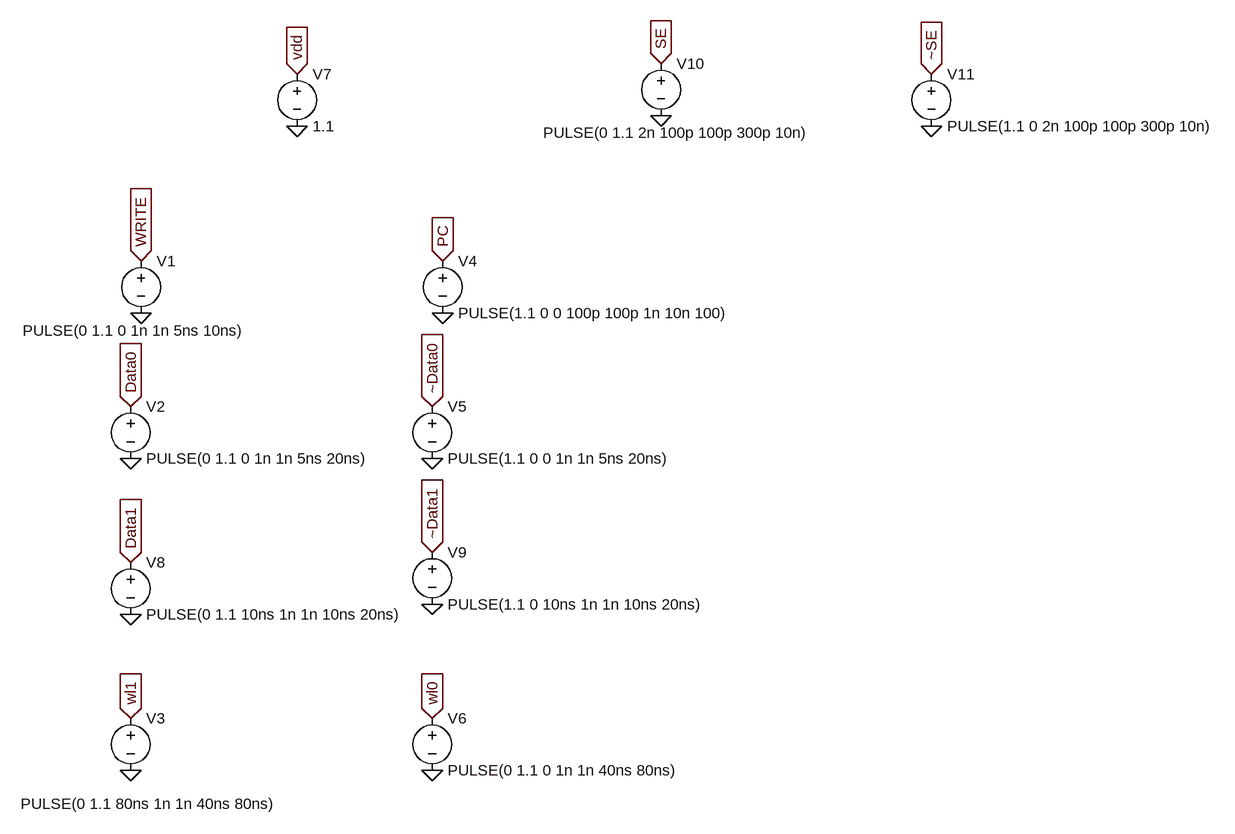
[diagram p0: schematic voltages.asc]
voltages.asc, the LTspice schematic file:
Version 4
SHEET 1 2000 680
FLAG 560 -384 0
FLAG 784 -96 0
FLAG 320 -96 0
FLAG 304 128 0
FLAG 768 128 0
FLAG 304 608 0
FLAG 768 608 0
FLAG 320 -176 WRITE
IOPIN 320 -176 In
FLAG 784 -176 PC
IOPIN 784 -176 In
FLAG 304 48 Data0
IOPIN 304 48 In
FLAG 768 48 ~Data0
IOPIN 768 48 In
FLAG 304 528 wl1
IOPIN 304 528 In
FLAG 768 528 wl0
IOPIN 768 528 In
FLAG 560 -464 vdd
IOPIN 560 -464 In
FLAG 768 352 0
FLAG 304 368 0
FLAG 304 288 Data1
IOPIN 304 288 In
FLAG 768 272 ~Data1
IOPIN 768 272 In
FLAG 1536 -384 0
FLAG 1120 -400 0
FLAG 1120 -480 SE
IOPIN 1120 -480 In
FLAG 1536 -464 ~SE
IOPIN 1536 -464 In
SYMBOL voltage 320 -192 R0
WINDOW 123 0 0 Left 2
WINDOW 39 0 0 Left 2
WINDOW 3 -182 123 Left 2
SYMATTR InstName V1
SYMATTR Value PULSE(0 1.1 0 1n 1n 5ns 10ns)
SYMBOL voltage 304 32 R0
WINDOW 123 0 0 Left 2
WINDOW 39 0 0 Left 2
SYMATTR InstName V2
SYMATTR Value PULSE(0 1.1 0 1n 1n 5ns 20ns)
SYMBOL voltage 304 512 R0
WINDOW 3 -169 147 Left 2
WINDOW 123 0 0 Left 2
WINDOW 39 0 0 Left 2
SYMATTR Value PULSE(0 1.1 80ns 1n 1n 40ns 80ns)
SYMATTR InstName V3
SYMBOL voltage 784 -192 R0
WINDOW 123 0 0 Left 2
WINDOW 39 0 0 Left 2
SYMATTR InstName V4
SYMATTR Value PULSE(1.1 0 0 100p 100p 1n 10n 100)
SYMBOL voltage 768 32 R0
WINDOW 123 0 0 Left 2
WINDOW 39 0 0 Left 2
SYMATTR InstName V5
SYMATTR Value PULSE(1.1 0 0 1n 1n 5ns 20ns)
SYMBOL voltage 768 512 R0
WINDOW 123 0 0 Left 2
WINDOW 39 0 0 Left 2
SYMATTR InstName V6
SYMATTR Value PULSE(0 1.1 0 1n 1n 40ns 80ns)
SYMBOL voltage 560 -480 R0
WINDOW 123 0 0 Left 2
WINDOW 39 0 0 Left 2
SYMATTR InstName V7
SYMATTR Value 1.1
SYMBOL voltage 304 272 R0
WINDOW 123 0 0 Left 0
WINDOW 39 0 0 Left 0
SYMATTR InstName V8
SYMATTR Value PULSE(0 1.1 10ns 1n 1n 10ns 20ns)
SYMBOL voltage 768 256 R0
WINDOW 123 0 0 Left 0
WINDOW 39 0 0 Left 0
SYMATTR InstName V9
SYMATTR Value PULSE(1.1 0 10ns 1n 1n 10ns 20ns)
SYMBOL voltage 1120 -496 R0
WINDOW 123 0 0 Left 2
WINDOW 39 0 0 Left 2
WINDOW 3 -181 122 Left 2
SYMATTR InstName V10
SYMATTR Value PULSE(0 1.1 2n 100p 100p 300p 10n)
SYMBOL voltage 1536 -480 R0
WINDOW 123 0 0 Left 2
WINDOW 39 0 0 Left 2
SYMATTR InstName V11
SYMATTR Value PULSE(1.1 0 2n 100p 100p 300p 10n)

The netlist it stands for:
* voltages.asc
V1 WRITE 0 PULSE(0 1.1 0 1n 1n 5ns 10ns)
V2 Data0 0 PULSE(0 1.1 0 1n 1n 5ns 20ns)
V3 wl1 0 PULSE(0 1.1 80ns 1n 1n 40ns 80ns)
V4 PC 0 PULSE(1.1 0 0 100p 100p 1n 10n 100)
V5 ~Data0 0 PULSE(1.1 0 0 1n 1n 5ns 20ns)
V6 wl0 0 PULSE(0 1.1 0 1n 1n 40ns 80ns)
V7 vdd 0 1.1
V8 Data1 0 PULSE(0 1.1 10ns 1n 1n 10ns 20ns)
V9 ~Data1 0 PULSE(1.1 0 10ns 1n 1n 10ns 20ns)
V10 SE 0 PULSE(0 1.1 2n 100p 100p 300p 10n)
V11 ~SE 0 PULSE(1.1 0 2n 100p 100p 300p 10n)
.backanno
.end